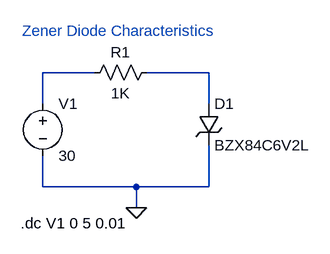
[diagram p0: schematic 2 Zener Diode Characteristics.asc]
2 Zener Diode Characteristics.asc, the LTspice schematic file:
Version 4
SHEET 1 880 680
WIRE 160 80 80 80
WIRE 336 80 240 80
WIRE 80 128 80 80
WIRE 336 128 336 80
WIRE 80 256 80 208
WIRE 224 256 80 256
WIRE 336 256 336 192
WIRE 336 256 224 256
WIRE 224 288 224 256
FLAG 224 288 0
SYMBOL voltage 80 112 R0
WINDOW 123 0 0 Left 0
WINDOW 39 0 0 Left 0
SYMATTR InstName V1
SYMATTR Value 30
SYMBOL res 256 64 R90
WINDOW 0 0 56 VBottom 2
WINDOW 3 32 56 VTop 2
SYMATTR InstName R1
SYMATTR Value 1K
SYMBOL zener 320 128 R0
SYMATTR InstName D1
SYMATTR Value BZX84C6V2L
TEXT 46 312 Left 2 !.dc V1 0 5 0.01
TEXT 48 16 Left 2 ;Zener Diode Characteristics

The netlist it stands for:
* 2 Zener Diode Characteristics.asc
V1 N001 0 30
R1 N002 N001 1K
D1 N002 0 BZX84C6V2L
.model D D
.lib standard.dio
.dc V1 0 5 0.01
* Zener Diode Characteristics
.backanno
.end